# Altium schematic sheet LED_7_Seg.SchDoc
size A; DocumentNumber: 2; SheetNumber: 2; SheetTotal: 2
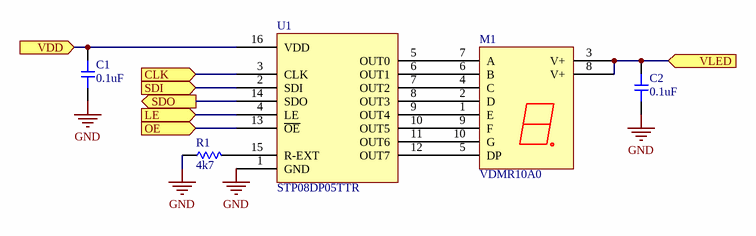
[diagram p0: LED_7_Seg.SchDoc]

## Parts
C1  value 0.1uF  [0603-CAP]  (hidden comment: Capacitor)
C2  value 0.1uF  [0603-CAP]  (hidden comment: Capacitor)
M1  VDMR10A0  [VDMR10A0]
R1  value 4k7  [0603-RES]  (hidden comment: Resistor)
U1  STP08DP05TTR  [TSOP65P640X120-16N]

## Ports
CLK (in), LE (in), OE (in), SDI (in), SDO (out), VDD (in), VLED (in)

## Nets
GND: C1.2 C2.2 R1.1 U1.1(GND)
CLK: U1.3(CLK) ; port CLK
LE: U1.4(LE) ; port LE
OE: U1.13(~{OE}) ; port OE
SDI: U1.2(SDI) ; port SDI
SDO: U1.14(SDO) ; port SDO
VDD: C1.1 U1.16(VDD) ; port VDD
VLED: C2.1 M1.3(V+) M1.8(V+) ; port VLED
NetM1_1: M1.1(E) U1.9(OUT4)
NetM1_2: M1.2(D) U1.8(OUT3)
NetM1_4: M1.4(C) U1.7(OUT2)
NetM1_5: M1.5(DP) U1.12(OUT7)
NetM1_6: M1.6(B) U1.6(OUT1)
NetM1_7: M1.7(A) U1.5(OUT0)
NetM1_9: M1.9(F) U1.10(OUT5)
NetM1_10: M1.10(G) U1.11(OUT6)
NetR1_2: R1.2 U1.15(R-EXT)

## Library data of the parts
M1 = VDMR10A0: DISPLAY 7SEG 0.39" SGL RED 10SMD; Supplier 1: Digi-Key; Supplier Part Number 1: VDMR10A0CT-ND
U1 = STP08DP05TTR: IC LED DRIVER LIN 100MA 16TSSOP; Supplier 1: Digi-Key; Supplier Part Number 1: 497-6029-1-ND
C1 C2 = Capacitor: Supplier 1: Digi-Key; Supplier Part Number 1: 311-1343-1-ND
R1 = Resistor: ComponentLink1URL: https://www.seielect.com/catalog/SEI-RMCF_RMCP.pdf?src-supplier=Avnet; ComponentLink1Description: https://www.seielect.com/catalog/SEI-RMCF_RMCP.pdf?src-supplier=Avnet; ComponentLink2URL: http://components.arrow.com/part/dataview/50497142S181428N1174?src-supplier=Arrow; ComponentLink2Description: http://components.arrow.com/part/dataview/50497142S181428N1174?src-supplier=Arrow; ComponentLink3URL: https://www.seielect.com/catalog/SEI-Packaging.pdf?src-supplier=Digi-Key; ComponentLink3Description: https://www.seielect.com/catalog/SEI-Packaging.pdf?src-supplier=Digi-Key; Supplier Part Number 1: YAG1304CT-ND; Supplier 1: Digi-Key